# Altium project Hardware2_Smartwatch.PrjPcb (part 3 of 3)
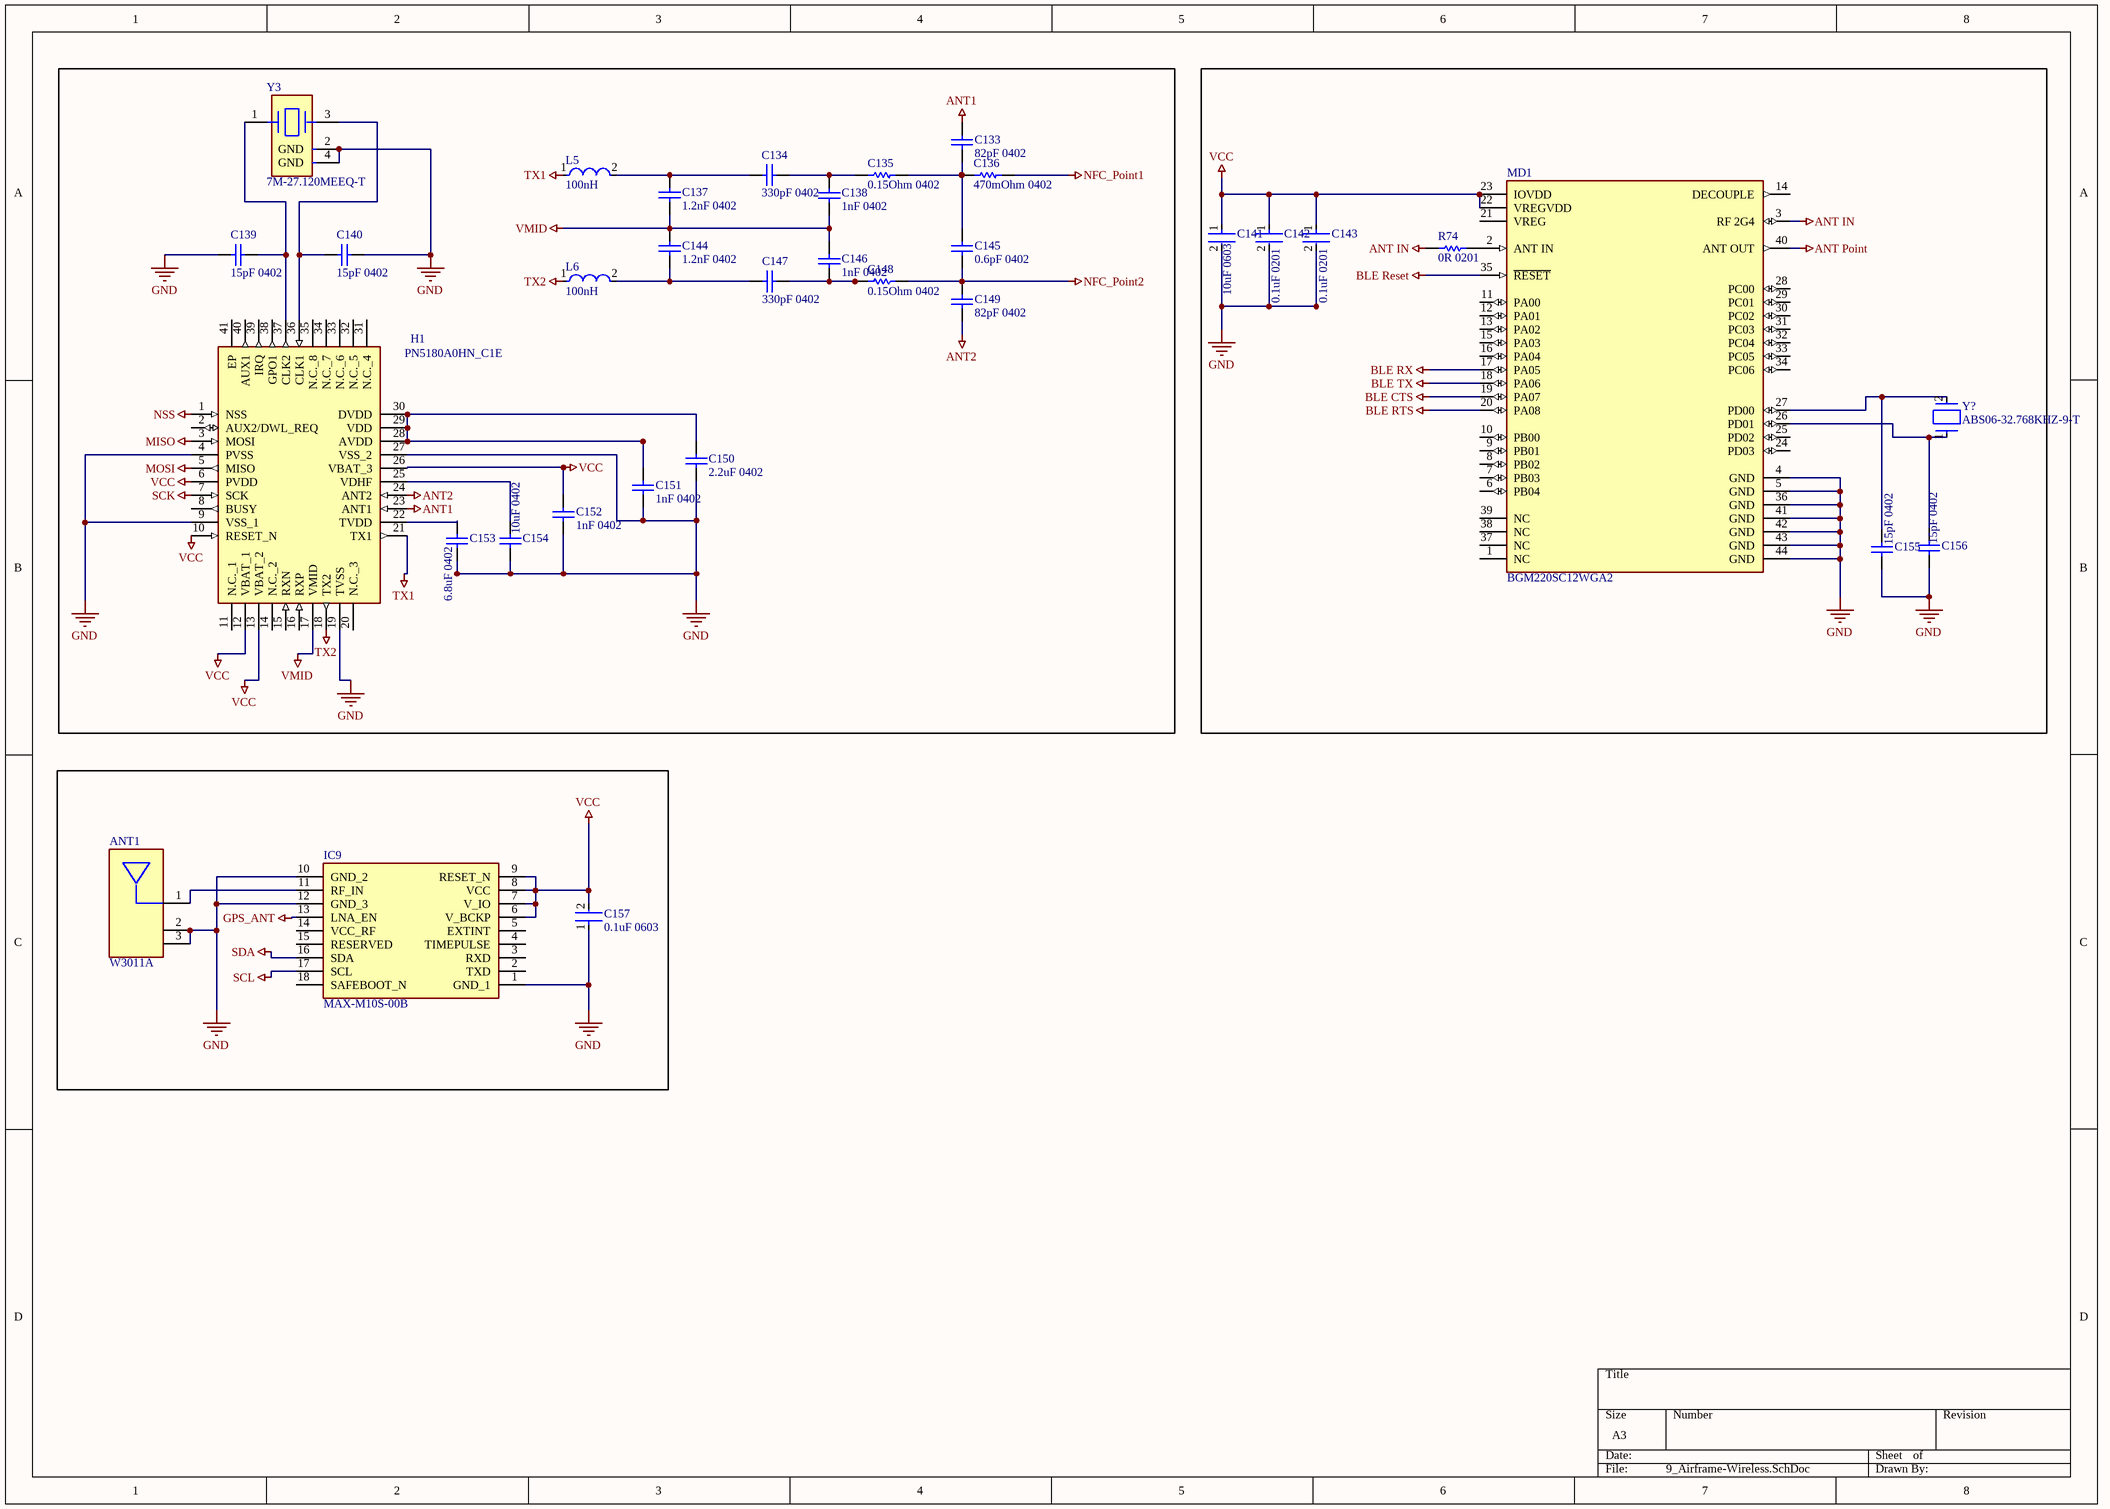
[diagram p10: 9_Airframe-Wireless.SchDoc]

## Nets that join several sheets
+0V675: 2_Airframe-Power_2 (C22.1 C23.1 IC2.3 IC2.5), 3_Airframe-Memory_1 (34 pins), 6_Airframe-NXP_i.MX7 (C120.1 U2.T20)
+1V0: 2_Airframe-Power_2 (5 pins), 8_Airframe-Misc (R66.1)
+1V8: 2_Airframe-Power_2 (C13.1 IC1.8 L4.2), 5_Airframe-NXP_i.MX7_Power (36 pins), 6_Airframe-NXP_i.MX7 (R53.2 R54.2 R55.2 R57.2), 8_Airframe-Misc (R72.1)
+1V35: 2_Airframe-Power_2 (7 pins), 3_Airframe-Memory_1 (23 pins), 5_Airframe-NXP_i.MX7_Power (50 pins), 8_Airframe-Misc (R71.1)
+3V0: 2_Airframe-Power_2 (C17.1 U1.5), 7_Airframe-Sensors (6 pins)
+VS: 2_Airframe-Power_2 (7 pins), 3_Airframe-Memory_1 (8 pins), 5_Airframe-NXP_i.MX7_Power (34 pins), 6_Airframe-NXP_i.MX7 (R51.2), 7_Airframe-Sensors (21 pins), 8_Airframe-Misc (8 pins), 9_Airframe-Wireless (16 pins)
BLE CTS: 6_Airframe-NXP_i.MX7 (U2.AB6), 9_Airframe-Wireless (MD1.19)
BLE RTS: 6_Airframe-NXP_i.MX7 (U2.AB5), 9_Airframe-Wireless (MD1.20)
BLE RX: 6_Airframe-NXP_i.MX7 (U2.T1), 9_Airframe-Wireless (MD1.17)
BLE TX: 6_Airframe-NXP_i.MX7 (U2.V1), 9_Airframe-Wireless (MD1.18)
CTR: 1_Airframe-Power_1 (16 pins), 2_Airframe-Power_2 (28 pins), 3_Airframe-Memory_1 (44 pins), 5_Airframe-NXP_i.MX7_Power (140 pins), 6_Airframe-NXP_i.MX7 (11 pins), 7_Airframe-Sensors (26 pins), 8_Airframe-Misc (17 pins), 9_Airframe-Wireless (31 pins)
CTR Int: 6_Airframe-NXP_i.MX7 (U2.Y5), 8_Airframe-Misc (J1.21)
CTR Reset: 6_Airframe-NXP_i.MX7 (U2.Y4), 8_Airframe-Misc (J1.18)
CTR SCL: 6_Airframe-NXP_i.MX7 (U2.N6), 8_Airframe-Misc (J1.20)
CTR SDA: 6_Airframe-NXP_i.MX7 (U2.N7), 8_Airframe-Misc (J1.19)
DDR3L A0: 3_Airframe-Memory_1 (R41.1), 6_Airframe-NXP_i.MX7 (U2.AC24)
DDR3L A1: 3_Airframe-Memory_1 (R40.1), 6_Airframe-NXP_i.MX7 (U2.AC25)
DDR3L A2: 3_Airframe-Memory_1 (R39.1), 6_Airframe-NXP_i.MX7 (U2.AC26)
DDR3L A3: 3_Airframe-Memory_1 (R38.1), 6_Airframe-NXP_i.MX7 (U2.AB25)
DDR3L A4: 3_Airframe-Memory_1 (R37.1), 6_Airframe-NXP_i.MX7 (U2.AB24)
DDR3L A5: 3_Airframe-Memory_1 (R36.1), 6_Airframe-NXP_i.MX7 (U2.AE23)
DDR3L A6: 3_Airframe-Memory_1 (R35.1), 6_Airframe-NXP_i.MX7 (U2.AF23)
DDR3L A7: 3_Airframe-Memory_1 (R34.1), 6_Airframe-NXP_i.MX7 (U2.AE22)
DDR3L A8: 3_Airframe-Memory_1 (R33.1), 6_Airframe-NXP_i.MX7 (U2.AD22)
DDR3L A9: 3_Airframe-Memory_1 (R32.1), 6_Airframe-NXP_i.MX7 (U2.AC22)
DDR3L A10: 3_Airframe-Memory_1 (R31.1), 6_Airframe-NXP_i.MX7 (U2.AD23)
DDR3L A11: 3_Airframe-Memory_1 (R30.1), 6_Airframe-NXP_i.MX7 (U2.AG27)
DDR3L A12: 3_Airframe-Memory_1 (R29.1), 6_Airframe-NXP_i.MX7 (U2.AE27)
DDR3L A13: 3_Airframe-Memory_1 (R28.1), 6_Airframe-NXP_i.MX7 (U2.AG28)
DDR3L A14: 3_Airframe-Memory_1 (R27.1), 6_Airframe-NXP_i.MX7 (U2.AE20)
DDR3L A15: 3_Airframe-Memory_1 (R26.1), 6_Airframe-NXP_i.MX7 (U2.AG26)
DDR3L BA0: 3_Airframe-Memory_1 (IC6.M2 R42.1), 6_Airframe-NXP_i.MX7 (U2.AE28)
DDR3L BA1: 3_Airframe-Memory_1 (IC6.N8 R43.1), 6_Airframe-NXP_i.MX7 (U2.AB22)
DDR3L BA2: 3_Airframe-Memory_1 (IC6.M3 R44.1), 6_Airframe-NXP_i.MX7 (U2.AF27)
DDR3L CAS#: 3_Airframe-Memory_1 (IC6.K3), 6_Airframe-NXP_i.MX7 (U2.AG25)
DDR3L CK: 3_Airframe-Memory_1 (IC6.J7 R25.2), 6_Airframe-NXP_i.MX7 (U2.AE25)
DDR3L CK#: 3_Airframe-Memory_1 (IC6.K7 R25.1), 6_Airframe-NXP_i.MX7 (U2.AF25)
DDR3L CKE: 3_Airframe-Memory_1 (IC6.K9), 6_Airframe-NXP_i.MX7 (U2.Y22)
DDR3L CS#: 3_Airframe-Memory_1 (IC6.L2), 6_Airframe-NXP_i.MX7 (U2.AE26)
DDR3L DQ0: 3_Airframe-Memory_1 (IC6.E3), 6_Airframe-NXP_i.MX7 (U2.AH22)
DDR3L DQ1: 3_Airframe-Memory_1 (IC6.F7), 6_Airframe-NXP_i.MX7 (U2.AG19)
DDR3L DQ2: 3_Airframe-Memory_1 (IC6.F2), 6_Airframe-NXP_i.MX7 (U2.AG20)
DDR3L DQ3: 3_Airframe-Memory_1 (IC6.F8), 6_Airframe-NXP_i.MX7 (U2.AF22)
DDR3L DQ4: 3_Airframe-Memory_1 (IC6.H3), 6_Airframe-NXP_i.MX7 (U2.AF20)
DDR3L DQ5: 3_Airframe-Memory_1 (IC6.H8), 6_Airframe-NXP_i.MX7 (U2.AG22)
DDR3L DQ6: 3_Airframe-Memory_1 (IC6.G2), 6_Airframe-NXP_i.MX7 (U2.AF21)
DDR3L DQ7: 3_Airframe-Memory_1 (IC6.H7), 6_Airframe-NXP_i.MX7 (U2.AH20)
DDR3L DQ8: 3_Airframe-Memory_1 (IC6.D7), 6_Airframe-NXP_i.MX7 (U2.AC18)
DDR3L DQ9: 3_Airframe-Memory_1 (IC6.C3), 6_Airframe-NXP_i.MX7 (U2.AB18)
DDR3L DQ10: 3_Airframe-Memory_1 (IC6.C8), 6_Airframe-NXP_i.MX7 (U2.AD16)
DDR3L DQ11: 3_Airframe-Memory_1 (IC6.C2), 6_Airframe-NXP_i.MX7 (U2.AC16)
DDR3L DQ12: 3_Airframe-Memory_1 (IC6.A7), 6_Airframe-NXP_i.MX7 (U2.AD18)
DDR3L DQ13: 3_Airframe-Memory_1 (IC6.A2), 6_Airframe-NXP_i.MX7 (U2.AE18)
DDR3L DQ14: 3_Airframe-Memory_1 (IC6.B8), 6_Airframe-NXP_i.MX7 (U2.AB16)
DDR3L DQ15: 3_Airframe-Memory_1 (IC6.A3), 6_Airframe-NXP_i.MX7 (U2.AE16)
DDR3L LDM: 3_Airframe-Memory_1 (IC6.E7), 6_Airframe-NXP_i.MX7 (U2.AH24)
DDR3L LDQS: 3_Airframe-Memory_1 (IC6.F3), 6_Airframe-NXP_i.MX7 (U2.AG24)
DDR3L LDQS#: 3_Airframe-Memory_1 (IC6.G3), 6_Airframe-NXP_i.MX7 (U2.AG23)
DDR3L NRST: 3_Airframe-Memory_1 (R46.2), 6_Airframe-NXP_i.MX7 (U2.V26)
DDR3L ODT: 3_Airframe-Memory_1 (IC6.K1), 6_Airframe-NXP_i.MX7 (U2.AF16)
DDR3L RAS#: 3_Airframe-Memory_1 (IC6.J3), 6_Airframe-NXP_i.MX7 (U2.AH25)
DDR3L UDM: 3_Airframe-Memory_1 (IC6.D3), 6_Airframe-NXP_i.MX7 (U2.AD20)
DDR3L UDQS: 3_Airframe-Memory_1 (IC6.C7), 6_Airframe-NXP_i.MX7 (U2.AB20)
DDR3L UDQS#: 3_Airframe-Memory_1 (IC6.B7), 6_Airframe-NXP_i.MX7 (U2.AC20)
DDR3L WE#: 3_Airframe-Memory_1 (IC6.L3), 6_Airframe-NXP_i.MX7 (U2.AH27)
Display CSX: 6_Airframe-NXP_i.MX7 (U2.R2), 8_Airframe-Misc (J1.9)
Display Reset: 6_Airframe-NXP_i.MX7 (U2.AB3), 8_Airframe-Misc (J1.10)
Display RS: 6_Airframe-NXP_i.MX7 (U2.AB4), 8_Airframe-Misc (J1.5)
Display SCL: 6_Airframe-NXP_i.MX7 (U2.N1), 8_Airframe-Misc (J1.8)
Display SDI: 6_Airframe-NXP_i.MX7 (U2.N2), 8_Airframe-Misc (J1.6)
Display SDO: 6_Airframe-NXP_i.MX7 (U2.P2), 8_Airframe-Misc (J1.7)
EEPROM Miso: 3_Airframe-Memory_1 (IC8.2), 6_Airframe-NXP_i.MX7 (U2.L3)
EEPROM Mosi: 3_Airframe-Memory_1 (IC8.5), 6_Airframe-NXP_i.MX7 (U2.M3)
EEPROM SCLK: 3_Airframe-Memory_1 (IC8.6), 6_Airframe-NXP_i.MX7 (U2.K2)
EEPROM SS0: 3_Airframe-Memory_1 (IC8.1), 6_Airframe-NXP_i.MX7 (U2.N3)
FLASH CLK: 3_Airframe-Memory_1 (IC7.B2), 6_Airframe-NXP_i.MX7 (U2.N23)
FLASH CS: 3_Airframe-Memory_1 (IC7.C2 R49.1), 6_Airframe-NXP_i.MX7 (U2.V7)
FLASH DI: 3_Airframe-Memory_1 (IC7.D3), 6_Airframe-NXP_i.MX7 (U2.U26)
FLASH DO: 3_Airframe-Memory_1 (IC7.D2), 6_Airframe-NXP_i.MX7 (U2.T27)
FLASH HOLD#: 3_Airframe-Memory_1 (IC7.D4 R47.1), 6_Airframe-NXP_i.MX7 (U2.T26)
FLASH RESET: 3_Airframe-Memory_1 (IC7.A4 R50.1), 6_Airframe-NXP_i.MX7 (U2.V6)
FLASH WP#: 3_Airframe-Memory_1 (IC7.C4 R48.1), 6_Airframe-NXP_i.MX7 (U2.R27)
GPS_ANT: 6_Airframe-NXP_i.MX7 (U2.AC6), 9_Airframe-Wireless (IC9.13)
IMU_CS: 6_Airframe-NXP_i.MX7 (U2.Y6), 7_Airframe-Sensors (U3.12)
SCL: 6_Airframe-NXP_i.MX7 (U2.N4), 7_Airframe-Sensors (6 pins), 8_Airframe-Misc (R68.2), 9_Airframe-Wireless (IC9.17)
SDA: 6_Airframe-NXP_i.MX7 (U2.N5), 7_Airframe-Sensors (6 pins), 8_Airframe-Misc (R67.2), 9_Airframe-Wireless (IC9.16)
Vbatt: 1_Airframe-Power_1 (Q3.2 R19.2), 2_Airframe-Power_2 (5 pins)